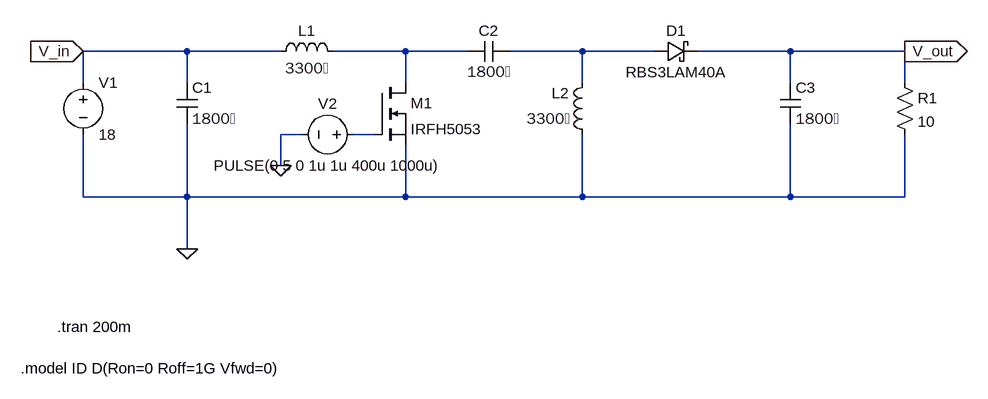
[diagram p0: schematic SEPIC.asc]
SEPIC.asc, the LTspice schematic file:
Version 4
SHEET 1 1472 680
WIRE 240 80 80 80
WIRE 384 80 240 80
WIRE 576 80 464 80
WIRE 672 80 576 80
WIRE 848 80 736 80
WIRE 960 80 848 80
WIRE 1168 80 1024 80
WIRE 1344 80 1168 80
WIRE 80 128 80 80
WIRE 240 128 240 80
WIRE 576 128 576 80
WIRE 848 128 848 80
WIRE 1168 128 1168 80
WIRE 1344 128 1344 80
WIRE 416 208 384 208
WIRE 528 208 496 208
WIRE 384 256 384 208
WIRE 80 304 80 208
WIRE 240 304 240 192
WIRE 240 304 80 304
WIRE 576 304 576 224
WIRE 576 304 240 304
WIRE 848 304 848 208
WIRE 848 304 576 304
WIRE 1168 304 1168 192
WIRE 1168 304 848 304
WIRE 1344 304 1344 208
WIRE 1344 304 1168 304
WIRE 240 384 240 304
FLAG 384 256 0
FLAG 240 384 0
FLAG 80 80 V_in
IOPIN 80 80 In
FLAG 1344 80 V_out
IOPIN 1344 80 Out
SYMBOL voltage 80 112 R0
WINDOW 123 0 0 Left 0
WINDOW 39 24 124 Left 2
SYMATTR InstName V1
SYMATTR Value 18
SYMBOL cap 224 128 R0
SYMATTR InstName C1
SYMATTR Value 1800�
SYMBOL ind 368 96 R270
WINDOW 0 32 56 VTop 2
WINDOW 3 5 56 VBottom 2
SYMATTR InstName L1
SYMATTR Value 3300�
SYMBOL ind 864 224 R180
WINDOW 0 36 80 Left 2
WINDOW 3 36 40 Left 2
SYMATTR InstName L2
SYMATTR Value 3300�
SYMBOL nmos 528 128 R0
SYMATTR InstName M1
SYMATTR Value IRFH5053
SYMBOL cap 736 64 R90
WINDOW 0 0 32 VBottom 2
WINDOW 3 32 32 VTop 2
SYMATTR InstName C2
SYMATTR Value 1800�
SYMBOL schottky 960 96 R270
WINDOW 0 32 32 VTop 2
WINDOW 3 0 32 VBottom 2
SYMATTR InstName D1
SYMATTR Value RBS3LAM40A
SYMBOL cap 1152 128 R0
SYMATTR InstName C3
SYMATTR Value 1800�
SYMBOL res 1328 112 R0
SYMATTR InstName R1
SYMATTR Value 10
SYMBOL voltage 512 208 R90
WINDOW 0 -32 56 VBottom 2
WINDOW 3 32 56 VTop 2
WINDOW 123 0 0 Left 0
WINDOW 39 0 0 Left 0
SYMATTR InstName V2
SYMATTR Value PULSE(0 5 0 1u 1u 400u 1000u)
TEXT 40 504 Left 2 !.tran 200m
TEXT -16 568 Left 2 !.model ID D(Ron=0 Roff=1G Vfwd=0)

The netlist it stands for:
* SEPIC.asc
V1 V_in 0 18
C1 V_in 0 1800�
L1 V_in N001 3300�
L2 0 N002 3300�
M1 N001 N003 0 0 IRFH5053
C2 N002 N001 1800�
D1 N002 V_out RBS3LAM40A
C3 V_out 0 1800�
R1 V_out 0 10
V2 N003 0 PULSE(0 5 0 1u 1u 400u 1000u)
.model D D
.lib standard.dio
.model NMOS NMOS
.model PMOS PMOS
.lib standard.mos
.tran 200m
.model ID D(Ron=0 Roff=1G Vfwd=0)
.backanno
.end